# EAGLE design tiny4l_18_1_99 (EAGLE 6.1)
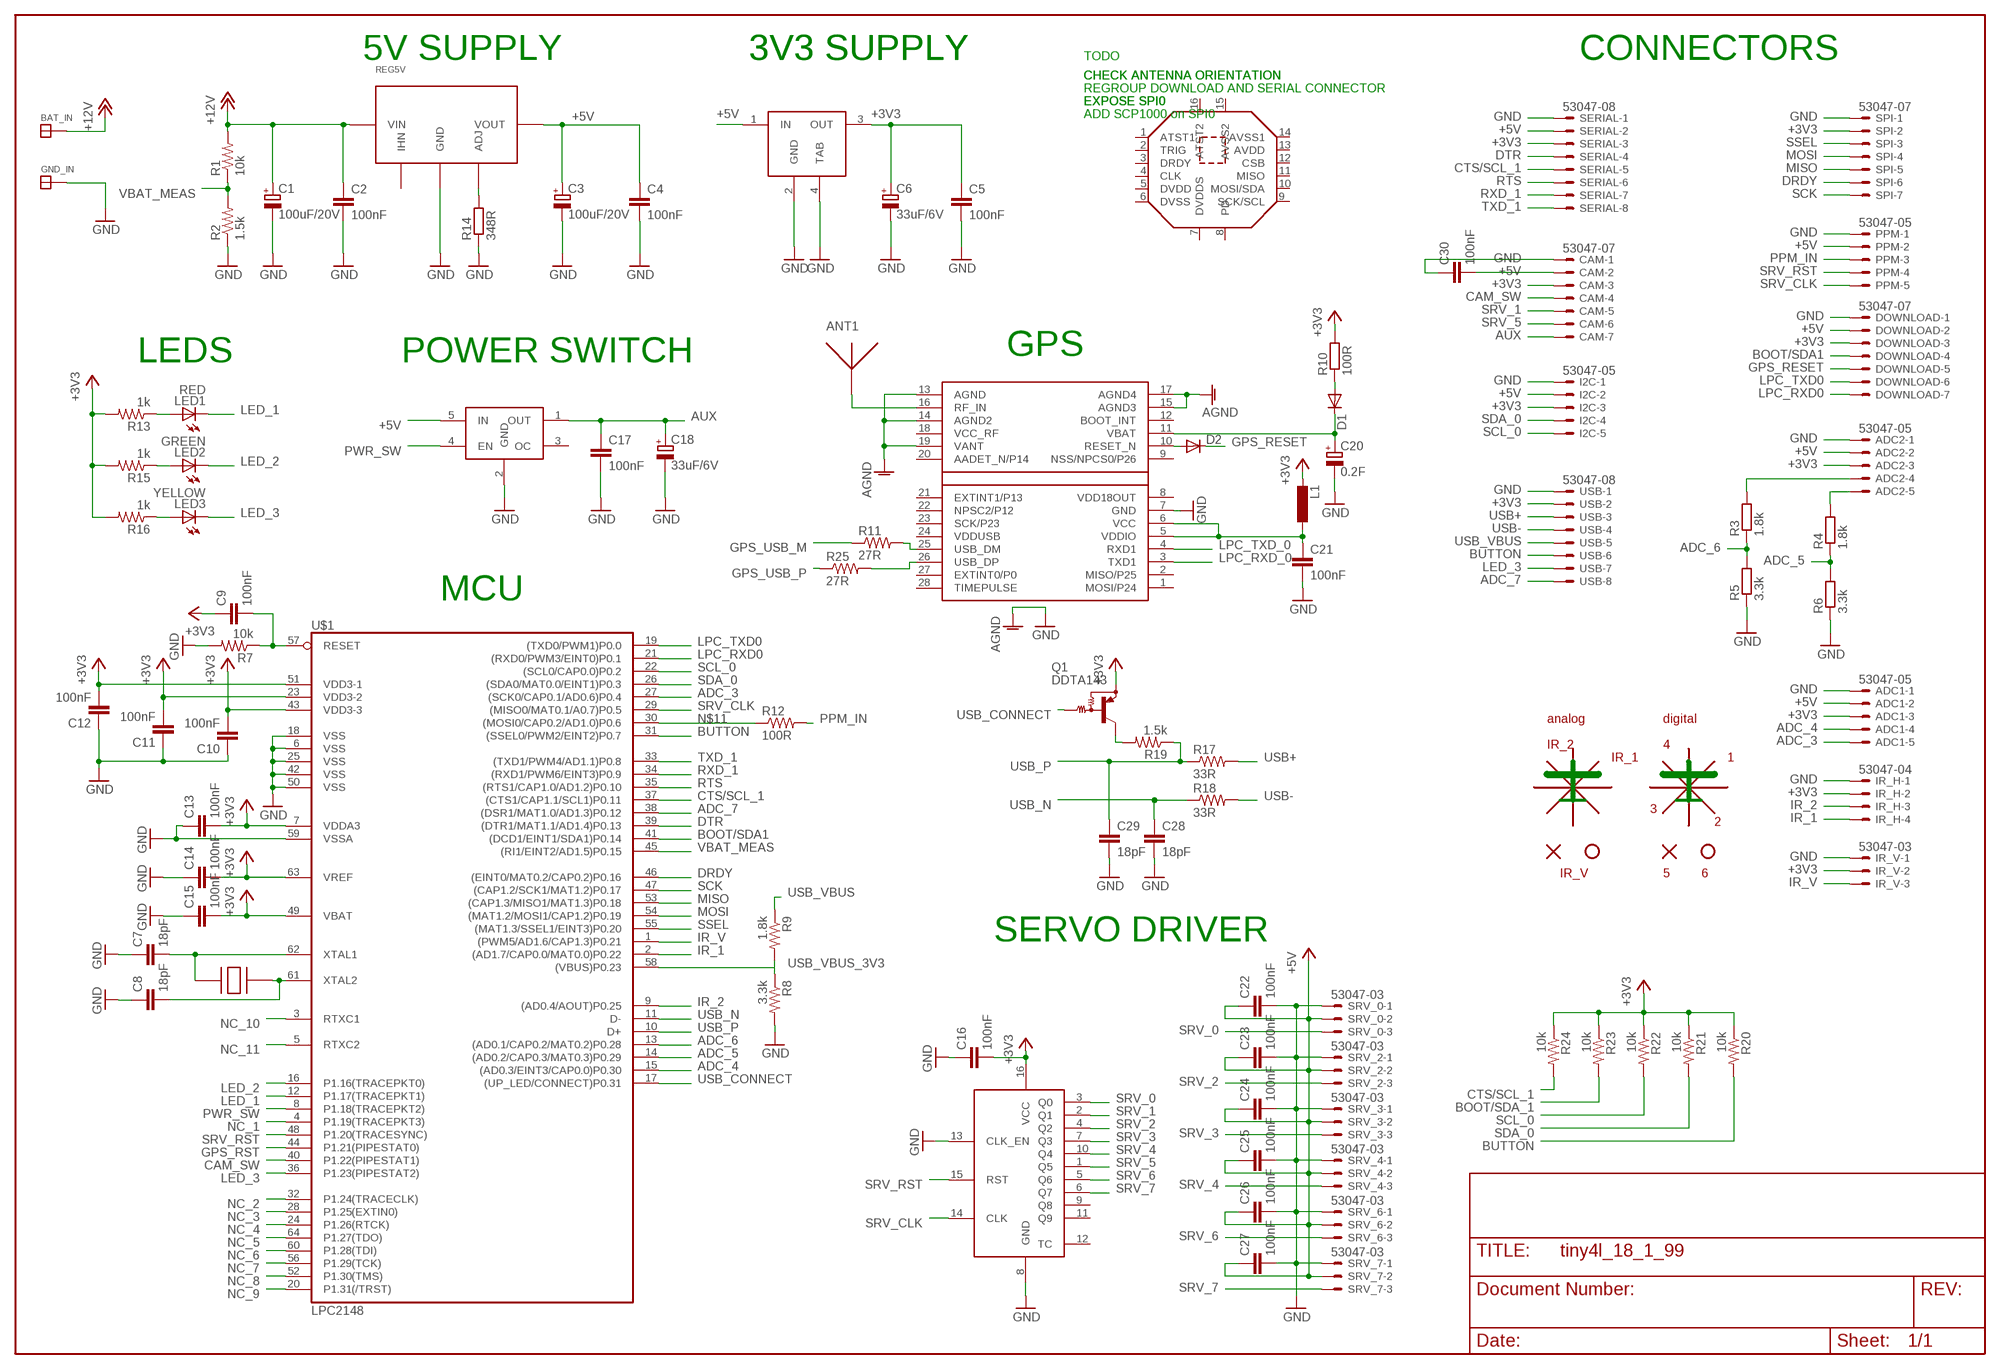
[diagram p0: schematic, sheet 1]

## Parts
ADC1  53047-05  [53047-05]
ADC2  53047-05  [53047-05]
ANT1  GPS_ANT_1318  [ANT_18]
BAT_IN  SOLDER_PAD150_75  [SOLD_PAD_150_75]
C1  100uF/20V  CPOL-EUSMCD  [SMC_D]
C2  100nF  C-EUC0603  [C0603]
C3  100uF/20V  CPOL-EUSMCD  [SMC_D]
C4  100nF  C-EUC0603  [C0603]
C5  100nF  C-EUC0603  [C0603]
C6  33uF/6V  CPOL-EUCT3216  [CT3216]
C7  18pF  C-EUC0603  [C0603]
C8  18pF  C-EUC0603  [C0603]
C9  100nF  C-EUC0603  [C0603]
C10  100nF  C-EUC0603  [C0603]
C11  100nF  C-EUC0603  [C0603]
C12  100nF  C-EUC0603  [C0603]
C13  100nF  C-EUC0603  [C0603]
C14  100nF  C-EUC0603  [C0603]
C15  100nF  C-EUC0603  [C0603]
C16  100nF  C-EUC0603  [C0603]
C17  100nF  C-EUC0603  [C0603]
C18  33uF/6V  CPOL-EUCT3216  [CT3216]
C20  0.2F  PANA_GOLDCAP_J1ROUND  [PANA_J1_BIS]
C21  100nF  C-EUC0603  [C0603]
C22  100nF  C-EUC0603  [C0603]
C23  100nF  C-EUC0603  [C0603]
C24  100nF  C-EUC0603  [C0603]
C25  100nF  C-EUC0603  [C0603]
C26  100nF  C-EUC0603  [C0603]
C27  100nF  C-EUC0603  [C0603]
C28  18pF  C-EUC0603  [C0603]
C29  18pF  C-EUC0603  [C0603]
C30  100nF  C-EUC0603  [C0603]
CAM  53047-07  [53047-07]
D1  DIODE-SOD523  [SOD523]
D2  DIODE-SOD523  [SOD523]
DOWNLOAD  53047-07  [53047-07]
GND_IN  SOLDER_PAD150_75  [SOLD_PAD_150_75]
I2C  53047-05  [53047-05]
IR_H  53047-04  [53047-04]
IR_V  53047-03  [53047-03]
L1  L-EUL2012C  [L2012C]
LED1  RED  LEDCHIP-LED0805  [CHIP-LED0805]
LED2  GREEN  LEDCHIP-LED0805  [CHIP-LED0805]
LED3  YELLOW  LEDCHIP-LED0805  [CHIP-LED0805]
PPM  53047-05  [53047-05]
Q1  DDTA143  MUN2111T1  [SC59-BEC]
R1  10k  R-US_R0603  [R0603]
R2  1.5k  R-US_R0603  [R0603]
R3  1.8k  R-EU_R0603  [R0603]
R4  1.8k  R-EU_R0603  [R0603]
R5  3.3k  R-EU_R0603  [R0603]
R6  3.3k  R-EU_R0603  [R0603]
R7  10k  R-US_R0603  [R0603]
R8  3.3k  R-US_R0603  [R0603]
R9  1.8k  R-US_R0603  [R0603]
R10  100R  R-EU_R0603  [R0603]
R11  27R  R-US_R0603  [R0603]
R12  100R  R-US_R0603  [R0603]
R13  1k  R-US_R0603  [R0603]
R14  348R  R-EU_R0603  [R0603]
R15  1k  R-US_R0603  [R0603]
R16  1k  R-US_R0603  [R0603]
R17  33R  R-US_R0603  [R0603]
R18  33R  R-US_R0603  [R0603]
R19  1.5k  R-US_R0603  [R0603]
R20  10k  R-US_R0603  [R0603]
R21  10k  R-US_R0603  [R0603]
R22  10k  R-US_R0603  [R0603]
R23  10k  R-US_R0603  [R0603]
R24  10k  R-US_R0603  [R0603]
R25  27R  R-US_R0603  [R0603]
REG5V  PTH  [PTH]
SERIAL  53047-08  [53047-08]
SPI  53047-07  [53047-07]
SRV_0  53047-03  [53047-03]
SRV_2  53047-03  [53047-03]
SRV_3  53047-03  [53047-03]
SRV_4  53047-03  [53047-03]
SRV_6  53047-03  [53047-03]
SRV_7  53047-03  [53047-03]
U$1  LPC2148  [SQFP-S-10X10-64]
U$2  LEA-4P  [LEA-LA]
U$3  LM3940IMP-3.3  [SOT223-R]
U$4  CRYSTAL_CTS  [CTS_CRYSTAL]
U$5  CD4017B  [TSSOP16]
U$6  TPS2051B  [SOT23-5L]
U$7  SCP1000  [SCP1000]
USB  53047-08  [53047-08]

## Nets
+3V3: ADC1.3 ADC2.3 C5.1 C6.+ C9.1 C10.2 C11.2 C12.2 C13.2 C14.2 C15.2 C16.2 CAM.3 DOWNLOAD.3 I2C.3 IR_H.2 IR_V.2 L1.2 Q1.E R10.2 R13.2 R15.2 R16.2 R20.1 R21.1 R22.1 R23.1 R24.1 SERIAL.3 SPI.2 U$1.7(VDDA3) U$1.23(VDD3-2) U$1.43(VDD3-3) U$1.49(VBAT) U$1.51(VDD3-1) U$1.63(VREF) U$3.3(OUT) U$5.16(VCC) USB.2
+5V: ADC1.2 ADC2.2 C3.+ C4.1 C22.1 C23.1 C24.1 C25.1 C26.1 C27.1 C30.2 CAM.2 DOWNLOAD.2 I2C.2 PPM.2 REG5V.P$3(VOUT) SERIAL.2 SRV_0.2 SRV_2.2 SRV_3.2 SRV_4.2 SRV_6.2 SRV_7.2 U$3.1(IN) U$6.5(IN)
+12V: BAT_IN.P$1 C1.+ C2.1 R1.2 REG5V.P$1(VIN)
ADC_3: ADC1.5 U$1.27((SCK0/CAP0.1/AD0.6)P0.4)
ADC_4: ADC1.4 U$1.15((AD0.3/EINT3/CAP0.0)P0.30)
ADC_5: R4.1 R6.2 U$1.14((AD0.2/CAP0.3/MAT0.3)P0.29)
ADC_6: R3.1 R5.2 U$1.13((AD0.1/CAP0.2/MAT0.2)P0.28)
ADC_7: U$1.38((DSR1/MAT1.0/AD1.3)P0.12) USB.8
AGND: U$2.13(AGND) U$2.14(AGND2) U$2.15(AGND3) U$2.17(AGND4) U$2.19(VANT) ; supply symbol labelled GND
AUX: C17.1 C18.+ CAM.7 U$6.1(OUT)
BOOT/SDA1: DOWNLOAD.4 U$1.41((DCD1/EINT1/SDA1)P0.14)
BOOT/SDA_1: R23.2
BUTTON: R20.2 U$1.31((SSEL0/PWM2/EINT2)P0.7) USB.6
CAM_SW: CAM.4 U$1.40(P1.22(PIPESTAT1))
CTS/SCL_1: R24.2 SERIAL.5 U$1.37((CTS1/CAP1.1/SCL1)P0.11)
DRDY: SPI.6 U$1.46((EINT0/MAT0.2/CAP0.2)P0.16)
DTR: SERIAL.4 U$1.39((DTR1/MAT1.1/AD1.4)P0.13)
GND: ADC1.1 ADC2.1 C1.- C2.2 C3.- C4.2 C5.2 C6.- C7.1 C8.1 C10.1 C11.1 C12.1 C13.1 C14.1 C15.1 C16.1 C17.2 C18.- C20.MINUS(-) C21.2 C22.2 C23.2 C24.2 C25.2 C26.2 C27.2 C28.2 C29.2 C30.1 CAM.1 DOWNLOAD.1 GND_IN.P$1 I2C.1 IR_H.1 IR_V.1 PPM.1 R2.1 R5.1 R6.1 R7.2 R8.2 R14.1 REG5V.P$2(GND) SERIAL.1 SPI.1 SRV_0.1 SRV_2.1 SRV_3.1 SRV_4.1 SRV_6.1 SRV_7.1 U$1.6(VSS) U$1.18(VSS) U$1.25(VSS) U$1.42(VSS) U$1.50(VSS) U$1.59(VSSA) U$2.7(GND) U$3.2(GND) U$3.4(TAB) U$5.8(GND) U$5.13(CLK_EN) U$6.2(GND) USB.1
GPS_RESET: D2.C DOWNLOAD.5
GPS_RST: U$1.44(P1.21(PIPESTAT0))
GPS_USB_M: R11.1
GPS_USB_P: R25.1
IR_1: IR_H.4 U$1.2((AD1.7/CAP0.0/MAT0.0)P0.22)
IR_2: IR_H.3 U$1.9((AD0.4/AOUT)P0.25)
IR_V: IR_V.3 U$1.1((PWM5/AD1.6/CAP1.3)P0.21)
LED_1: LED1.C U$1.12(P1.17(TRACEPKT1))
LED_2: LED2.C U$1.16(P1.16(TRACEPKT0))
LED_3: LED3.C U$1.36(P1.23(PIPESTAT2)) USB.7
LPC_RESET: C9.2 R7.1 U$1.57(RESET)
LPC_RXD0: DOWNLOAD.7 U$1.21((RXD0/PWM3/EINT0)P0.1)
LPC_RXD_0: U$2.3(TXD1)
LPC_TXD0: DOWNLOAD.6 U$1.19((TXD0/PWM1)P0.0)
LPC_TXD_0: U$2.4(RXD1)
MISO: SPI.5 U$1.53((CAP1.3/MISO1/MAT1.3)P0.18)
MOSI: SPI.4 U$1.54((MAT1.2/MOSI1/CAP1.2)P0.19)
N$1: LED1.A R13.1
N$2: C7.2 U$1.62(XTAL1) U$4.P$1
N$3: D1.A R10.1
N$4: C8.2 U$1.61(XTAL2) U$4.P$3
N$5: R14.2 REG5V.P$4(ADJ)
N$6: LED2.A R15.1
N$7: LED3.A R16.1
N$8: ANT1.P$1 U$2.16(RF_IN)
N$9: D2.A U$2.10(RESET_N)
N$10: C20.PLUS(+) D1.C U$2.11(VBAT)
N$11: R12.1 U$1.30((MOSI0/CAP0.2/AD1.0)P0.6)
N$12: R8.1 R9.2
N$13: C21.1 L1.1 U$2.5(VDDIO) U$2.6(VCC)
N$14: Q1.C R19.2
N$15: R11.2 U$2.25(USB_DM)
N$16: R25.2 U$2.26(USB_DP)
N$43: ADC2.4 R3.2
N$44: ADC2.5 R4.2
NC_1: U$1.4(P1.19(TRACEPKT3))
NC_2: U$1.32(P1.24(TRACECLK))
NC_3: U$1.28(P1.25(EXTIN0))
NC_4: U$1.24(P1.26(RTCK))
NC_5: U$1.64(P1.27(TDO))
NC_6: U$1.60(P1.28(TDI))
NC_7: U$1.56(P1.29(TCK))
NC_8: U$1.52(P1.30(TMS))
NC_9: U$1.20(P1.31(/TRST))
NC_10: U$1.3(RTXC1)
NC_11: U$1.5(RTXC2)
PPM_IN: PPM.3 R12.2
PWR_SW: U$1.8(P1.18(TRACEPKT2)) U$6.4(EN)
RTS: SERIAL.6 U$1.35((RTS1/CAP1.0/AD1.2)P0.10)
RXD_1: SERIAL.7 U$1.34((RXD1/PWM6/EINT3)P0.9)
SCK: SPI.7 U$1.47((CAP1.2/SCK1/MAT1.2)P0.17)
SCL_0: I2C.5 R22.2 U$1.22((SCL0/CAP0.0)P0.2)
SDA_0: I2C.4 R21.2 U$1.26((SDA0/MAT0.0/EINT1)P0.3)
SRV_0: SRV_0.3 U$5.3(Q0)
SRV_1: CAM.5 U$5.2(Q1)
SRV_2: SRV_2.3 U$5.4(Q2)
SRV_3: SRV_3.3 U$5.7(Q3)
SRV_4: SRV_4.3 U$5.10(Q4)
SRV_5: CAM.6 U$5.1(Q5)
SRV_6: SRV_6.3 U$5.5(Q6)
SRV_7: SRV_7.3 U$5.6(Q7)
SRV_CLK: PPM.5 U$1.29((MISO0/MAT0.1/A0.7)P0.5) U$5.14(CLK)
SRV_RST: PPM.4 U$1.48(P1.20(TRACESYNC)) U$5.15(RST)
SSEL: SPI.3 U$1.55((MAT1.3/SSEL1/EINT3)P0.20)
TXD_1: SERIAL.8 U$1.33((TXD1/PWM4/AD1.1)P0.8)
USB+: R17.2 USB.3
USB-: R18.2 USB.4
USB_CONNECT: Q1.B U$1.17((UP_LED/CONNECT)P0.31)
USB_N: C28.1 R18.1 U$1.11(D-)
USB_P: C29.1 R17.1 R19.1 U$1.10(D+)
USB_VBUS: R9.1 USB.5
USB_VBUS_3V3: U$1.58((VBUS)P0.23)
VBAT_MEAS: R1.1 R2.2 U$1.45((RI1/EINT2/AD1.5)P0.15)
Unconnected: REG5V.P$5(IHN) U$2.1(MOSI/P24) U$2.2(MISO/P25) U$2.9(NSS/NPCS0/P26) U$2.12(BOOT_INT) U$2.20(AADET_N/P14) U$2.21(EXTINT1/P13) U$2.22(NPSC2/P12) U$2.23(SCK/P23) U$2.24(VDDUSB) U$2.27(EXTINT0/P0) U$2.28(TIMEPULSE) U$5.9(Q8) U$5.11(Q9) U$5.12(TC) U$6.3(OC) U$7.1(ATST1) U$7.2(TRIG) U$7.3(DRDY) U$7.4(CLK) U$7.5(DVDD) U$7.6(DVSS) U$7.7(DVDDS) U$7.8(PD) U$7.9(SCK/SCL) U$7.10(MOSI/SDA) U$7.11(MISO) U$7.12(CSB) U$7.13(AVDD) U$7.14(AVSS1) U$7.15(AVSS2) U$7.16(ATST2)

## Notes on the sheet
- 5V SUPPLY | 3V3 SUPPLY | 3V3 SUPPLY | TODO | CONNECTORS
- CHECK ANTENNA ORIENTATION | CHECK ANTENNA ORIENTATION
- REGROUP DOWNLOAD AND SERIAL CONNECTOR
- EXPOSE SPI0 | EXPOSE SPI0
- ADD SCP1000 on SPI0
- LEDS | POWER SWITCH | GPS
- MCU
- analog | digital
- IR_2 | 4
- IR_1 | 1
- 3
- 2
- IR_V | 5 | 6
- SERVO DRIVER

## Power pins joined to a net without a drawn wire
VCC_RF: U$2.18(VCC_RF)
VDD18OUT: U$2.8(VDD18OUT)

## Library data of the parts
ADC1 ADC2 I2C PPM = con-molex:53?-05: CONNECTOR wire to board 1.25 mm (.049 inch) pitch header
ANT1 = paparazzi:GPS_ANT_13: Sangshin KSA-ST1575MS13
BAT_IN GND_IN = paparazzi:SOLDER_PAD
C1 C3 C6 C18 = rcl:CPOL-EU: POLARIZED CAPACITOR, European symbol
C2 C4 C5 C7-C17 C21-C30 = rcl:C-EU: CAPACITOR, European symbol
C20 = paparazzi:PANA_GOLDCAP_J1
CAM DOWNLOAD SPI = con-molex:53?-07: CONNECTOR wire to board 1.25 mm (.049 inch) pitch header
D1 D2 = diode:DIODE-: DIODE
IR_H = con-molex:53?-04: CONNECTOR wire to board 1.25 mm (.049 inch) pitch header
IR_V SRV_0 SRV_2-SRV_4 SRV_6 SRV_7 = con-molex:53?-03: CONNECTOR wire to board 1.25 mm (.049 inch) pitch header
L1 = rcl:L-EU: INDUCTOR, European symbol
LED1-LED3 = led:LED: LED OSRAM: - CHIPLED LG R971, LG N971, LY N971, LG Q971, LY Q971, LO R971, LY R971 LH N974, LH R974 LS Q976, LO Q976, LY Q976 LO Q996 - Hyper CHIPLED LW Q18S LB Q993, LB Q99A, LB R99A - SideLED LS A670, LO A670, LY A670, LG A670, LP A670 LB A673, LV A673, LT A673, LW A673 LH A674 LY A675 LS A676, LA A676, LO A676, LY A676, LW A676 LS A679, LY A679, LG A679 - Hyper Micro SIDELED® LS Y876, LA Y876, LO Y876, LY Y876 LT Y87S - SmartLED LW L88C, LW L88S LB L89C, LB L89S, LG L890 LS L89K, LO L89K, LY L89K LS L896, LA L896, LO L896, LY L896 - TOPLED LS T670, LO T670, LY T670, LG T670, LP T670 LSG T670, LSP T670, LSY T670, LOP T670, LYG T670 LG T671, LOG T671, LSG T671 LB T673, LV T673, LT T673, LW T673 LH T674 LS T676, LA T676, LO T676, LY T676, LB T676, LH T676, LSB T676, LW T676 LB T67C, LV T67C, LT T67C, LS T67K, LO T67K, LY T67K, LW E67C LS E67B, LA E67B, LO E67B, LY E67B, LB E67C, LV E67C, LT E67C LW T67C LS T679, LY T679, LG T679 LS T770, LO T770, LY T770, LG T770, LP T770 LB T773, LV T773, LT T773, LW T773 LH T774 LS E675, LA E675, LY E675, LS T675 LS T776, LA T776, LO T776, LY T776, LB T776 LHGB T686 LT T68C, LB T68C - Hyper Mini TOPLED® LB M676 - Mini TOPLED Santana® LG M470 LS M47K, LO M47K, LY M47K Source: http://www.osram.convergy.de - LUMILED® LXK2-PW12-R00, LXK2-PW12-S00, LXK2-PW14-U00, LXK2-PW14-V00 LXK2-PM12-R00, LXK2-PM12-S00, LXK2-PM14-U00 LXK2-PE12-Q00, LXK2-PE12-R00, LXK2-PE12-S00, LXK2-PE14-T00, LXK2-PE14-U00 LXK2-PB12-K00, LXK2-PB12-L00, LXK2-PB12-M00, LXK2-PB14-N00, LXK2-PB14-P00, LXK2-PB14-Q00 LXK2-PR12-L00, LXK2-PR12-M00, LXK2-PR14-Q00, LXK2-PR14-R00 LXK2-PD12-Q00, LXK2-PD12-R00, LXK2-PD12-S00 LXK2-PH12-R00, LXK2-PH12-S00 LXK2-PL12-P00, LXK2-PL12-Q00, LXK2-PL12-R00 Source: www.luxeon.com
Q1 = transistor-pnp:MUN2111*: PNP Bias Resistor Transistor
R1 R2 R7-R9 R11-R13 R15-R25 = rcl:R-US_: RESISTOR, American symbol
R3-R6 R10 R14 = rcl:R-EU_: RESISTOR, European symbol
REG5V = paparazzi:PTH
SERIAL USB = con-molex:53?-08: CONNECTOR wire to board 1.25 mm (.049 inch) pitch header
U$1 = paparazzi:LPC2148
U$2 = paparazzi:LEA-4P
U$3 = paparazzi:LM3940IMP-3.3
U$4 = paparazzi:CRYSTAL_CTS
U$5 = paparazzi:CD4017B
U$6 = paparazzi:TPS2051B
U$7 = paparazzi:SCP1000

## Board
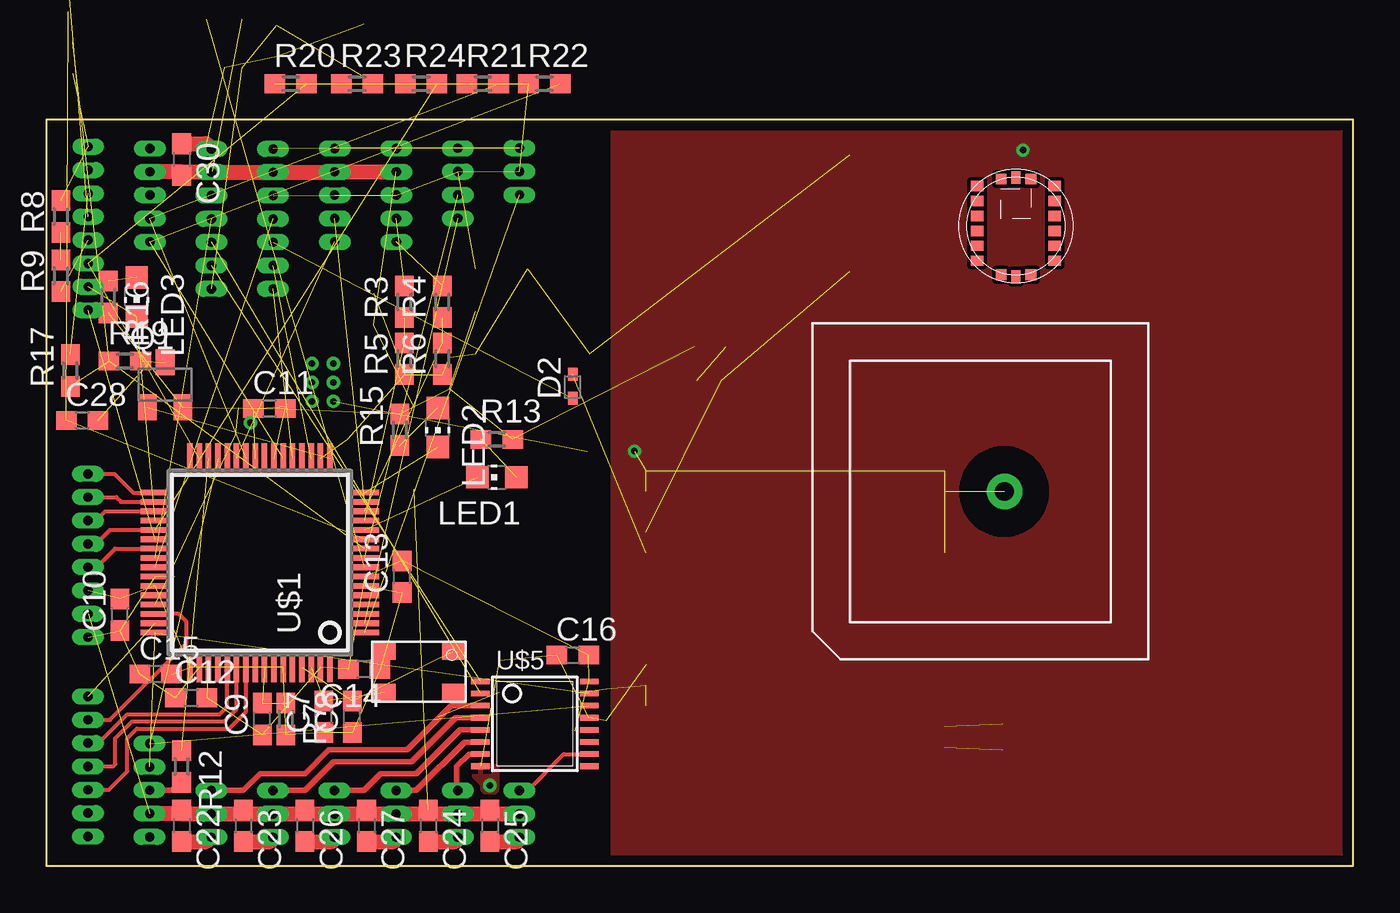
[diagram p1: board, top side]
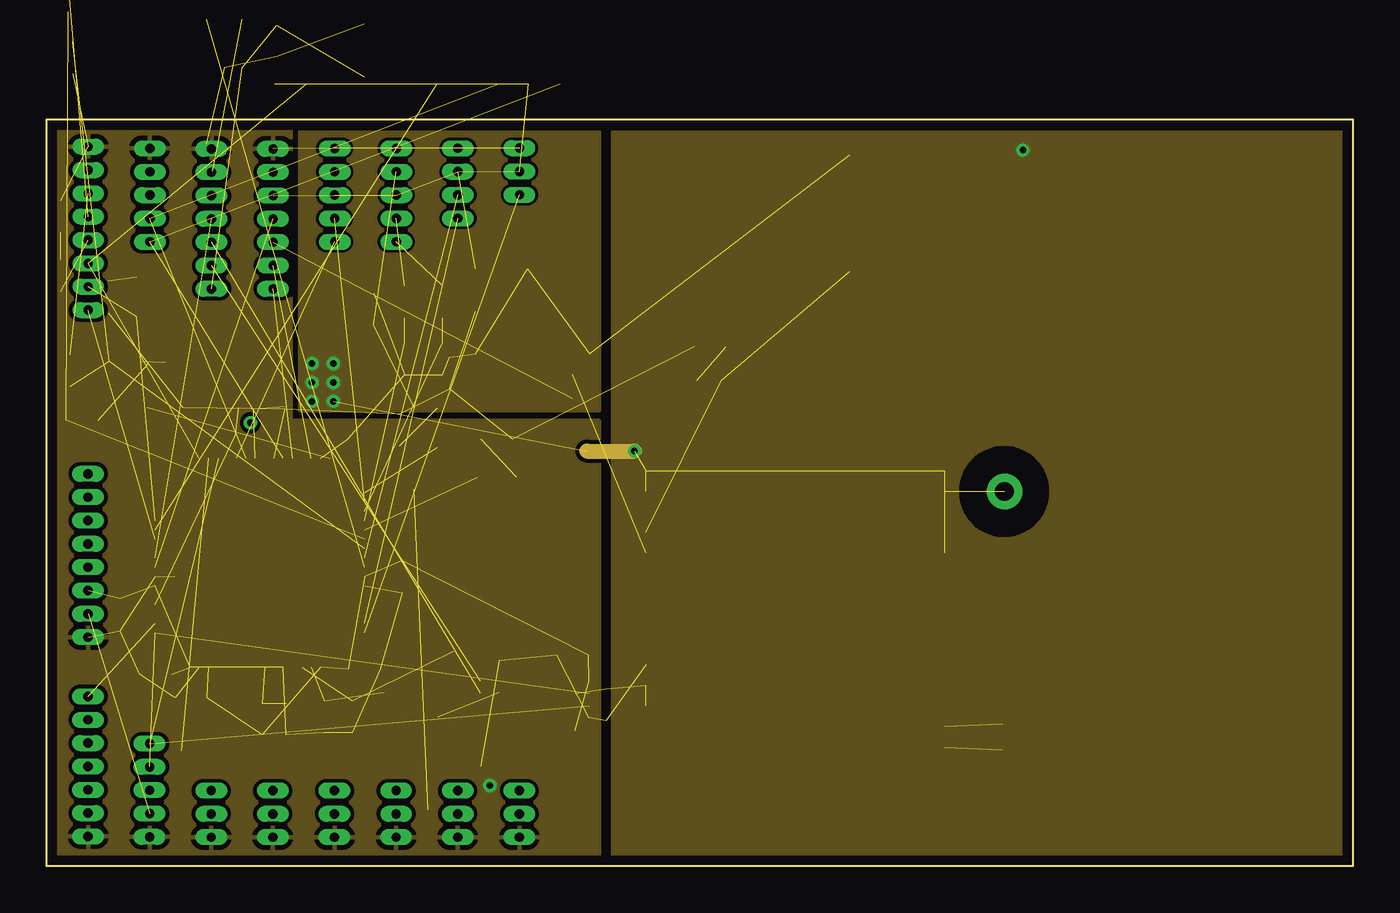
[diagram p2: board, inner layer Route2]
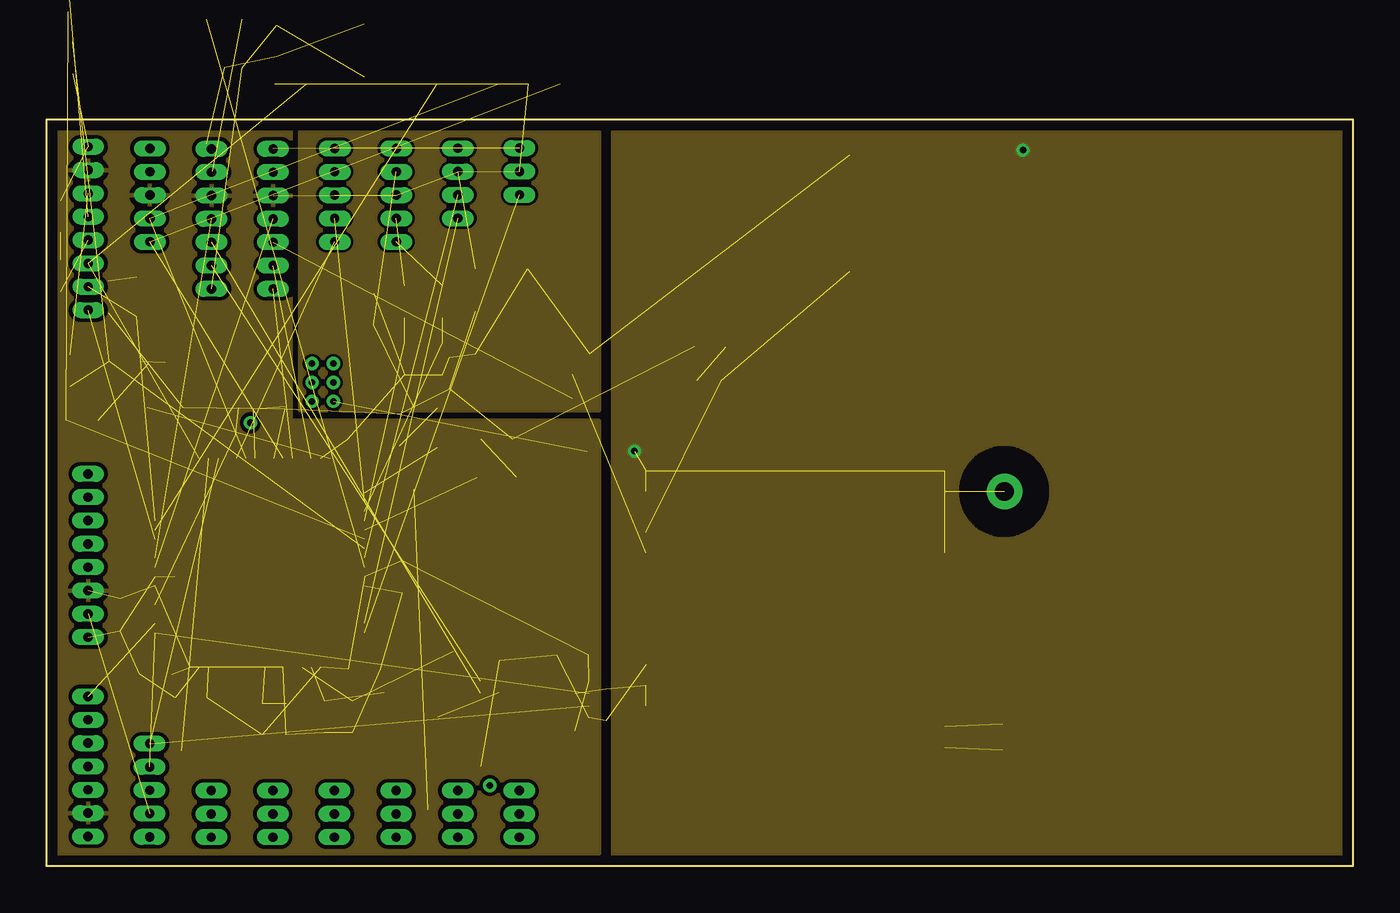
[diagram p3: board, inner layer Route15]
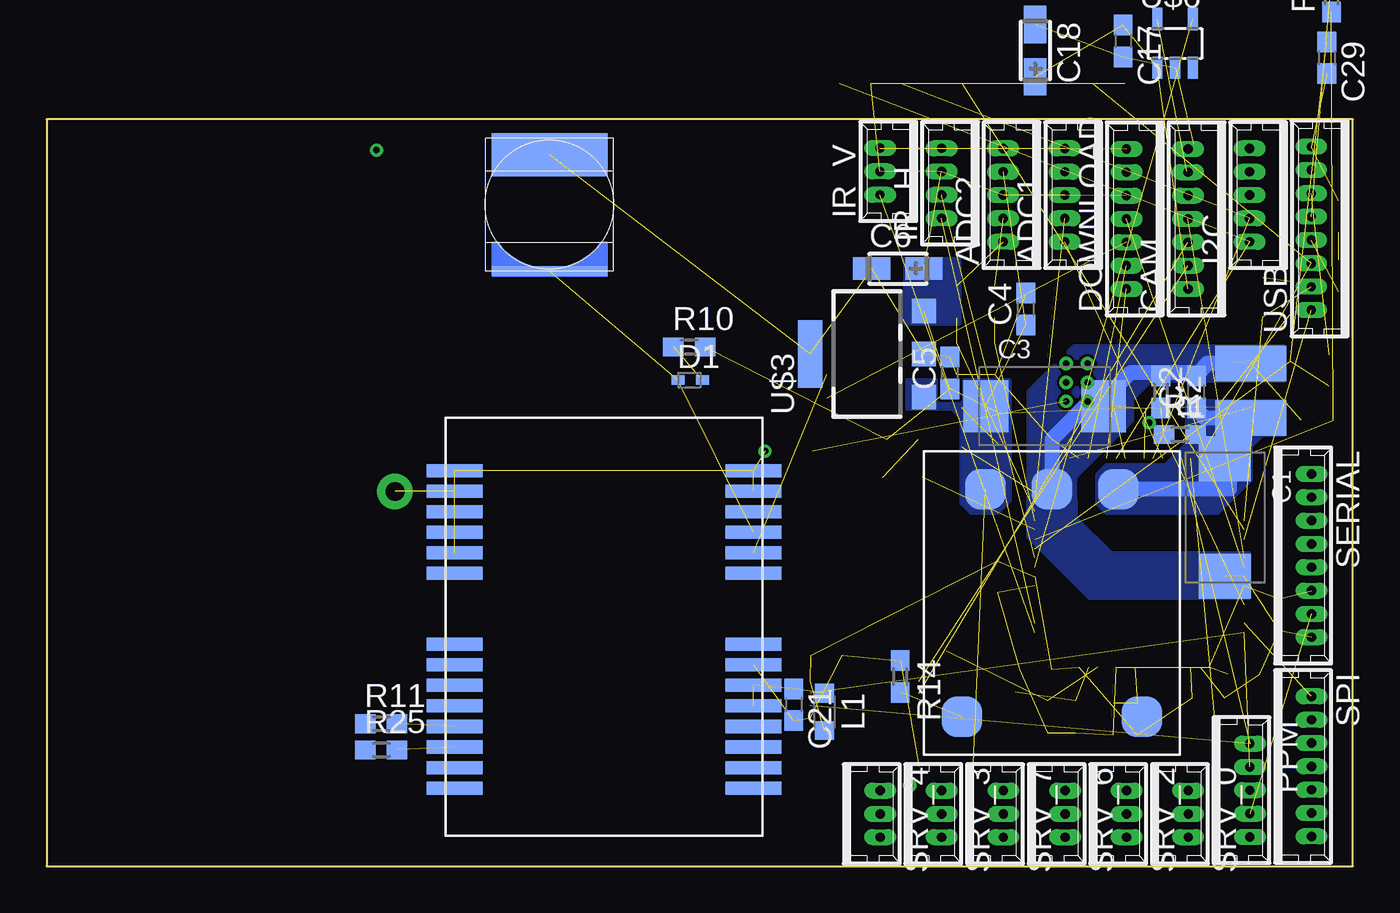
[diagram p4: board, bottom side, seen from below]

Size 70 x 40 mm. Coordinates in mm from the lower left corner, seen from the top.
Outline: 0,0 0,40 70,40 70,0 0,0
Copper layers (1*2+15*16): Top 0.035mm / dielectric 0.2mm / Route2 0.035mm / dielectric 1.5mm / Route15 0.035mm / dielectric 0.2mm / Bottom 0.035mm
Design rules: minimum track width 0.15mm, minimum drill 0.35mm, track to track 0.15mm, track to pad 0.15mm, pad to pad 0.15mm, via to via 0.15mm, smd to smd 0.15mm, copper to edge 20mil, drill to drill 8mil, minimum pad ring 0.177mm, minimum via ring 0.177mm, stop-mask expansion 4mil, vias tented up to drill 0mil, thermal gap 10mil

### Footprints (pad centres in the part's own frame; a part is rotated, then mirrored left to right if it is on the bottom)
53047-05 = drill 0.5 pad 0.698 long: 1 2.5,0.45; 2 1.25,0.45; 3 0,0.45; 4 -1.25,0.45; 5 -2.5,0.45
ANT_18 = drill 1.016 pad 1.905: P$1 0,-1.3
SOLD_PAD_150_75 = smd 3.81 x 1.905: P$1 0,0
SMC_D = smd 2.4 x 2.8: + -3.15,0; - 3.15,0
C0603 = smd 1.1 x 1: 1 -0.85,0; 2 0.85,0
CT3216 = smd 2 x 1.2: + 1.4,0; - -1.4,0
PANA_J1_BIS = smd 6.2 x 2.3: MINUS 0,-2.794 | smd 6.198 x 0.508: PLUS 0,3.429
53047-07 = drill 0.5 pad 0.698 long: 1 3.75,0.45; 2 2.5,0.45; 3 1.25,0.45; 4 0,0.45; 5 -1.25,0.45; 6 -2.5,0.45; 7 -3.75,0.45
SOD523 = smd 0.7 x 0.5: A 0.7,0; C -0.6,0
53047-04 = drill 0.5 pad 0.698 long: 1 1.875,0.45; 2 0.625,0.45; 3 -0.625,0.45; 4 -1.875,0.45
53047-03 = drill 0.5 pad 0.698 long: 1 1.25,0.45; 2 0,0.45; 3 -1.25,0.45
L2012C = smd 1 x 1: 1 -1,0; 2 1,0
CHIP-LED0805 = smd 1.2 x 1.2: A 0,-1.05; C 0,1.05
SC59-BEC = smd 1 x 1.4: B -0.95,-1.2; C 0,1.2; E 0.95,-1.2
R0603 = smd 1.1 x 1: 1 -0.85,0; 2 0.85,0
PTH = smd 2.184 x 2.184: P$1 -6.096,3.556; P$2 -6.096,0; P$3 -6.096,-3.556; P$4 6.096,-4.826; P$5 6.096,4.826
53047-08 = drill 0.5 pad 0.698 long: 1 4.375,0.45; 2 3.125,0.45; 3 1.875,0.45; 4 0.625,0.45; 5 -0.625,0.45; 6 -1.875,0.45; 7 -3.125,0.45; 8 -4.375,0.45
SQFP-S-10X10-64 = smd 0.3 x 1.6: 1 -3.75,-5.6; 2 -3.25,-5.6; 3 -2.75,-5.6; 4 -2.25,-5.6; 5 -1.75,-5.6; 6 -1.25,-5.6; 7 -0.75,-5.6; 8 -0.25,-5.6; 9 0.25,-5.6; 10 0.75,-5.6; 11 1.25,-5.6; 12 1.75,-5.6; 13 2.25,-5.6; 14 2.75,-5.6; 15 3.25,-5.6; 16 3.75,-5.6; 33 3.75,5.6; 34 3.25,5.6; 35 2.75,5.6; 36 2.25,5.6; 37 1.75,5.6; 38 1.25,5.6; 39 0.75,5.6; 40 0.25,5.6; 41 -0.25,5.6; 42 -0.75,5.6; 43 -1.25,5.6; 44 -1.75,5.6; 45 -2.25,5.6; 46 -2.75,5.6; 47 -3.25,5.6; 48 -3.75,5.6 | smd 1.6 x 0.3: 17 5.6,-3.75; 18 5.6,-3.25; 19 5.6,-2.75; 20 5.6,-2.25; 21 5.6,-1.75; 22 5.6,-1.25; 23 5.6,-0.75; 24 5.6,-0.25; 25 5.6,0.25; 26 5.6,0.75; 27 5.6,1.25; 28 5.6,1.75; 29 5.6,2.25; 30 5.6,2.75; 31 5.6,3.25; 32 5.6,3.75; 49 -5.6,3.75; 50 -5.6,3.25; 51 -5.6,2.75; 52 -5.6,2.25; 53 -5.6,1.75; 54 -5.6,1.25; 55 -5.6,0.75; 56 -5.6,0.25; 57 -5.6,-0.25; 58 -5.6,-0.75; 59 -5.6,-1.25; 60 -5.6,-1.75; 61 -5.6,-2.25; 62 -5.6,-2.75; 63 -5.6,-3.25; 64 -5.6,-3.75
LEA-LA = smd 3 x 0.7: 1 8,-8.65; 2 8,-7.55; 3 8,-6.45; 4 8,-5.35; 5 8,-4.25; 6 8,-3.15; 7 8,-2.05; 8 8,-0.95; 9 8,2.85; 10 8,3.95; 11 8,5.05; 12 8,6.15; 13 8,7.25; 14 8,8.35; 15 -8,8.35; 16 -8,7.25; 17 -8,6.15; 18 -8,5.05; 19 -8,3.95; 20 -8,2.85; 21 -8,-0.95; 22 -8,-2.05; 23 -8,-3.15; 24 -8,-4.25; 25 -8,-5.35; 26 -8,-6.45; 27 -8,-7.55; 28 -8,-8.65
SOT223-R = smd 1.3 x 1.3: 1 -2.3,-3.05; 2 0,-3.05; 3 2.3,-3.05 | smd 3.6 x 1.3: 4 0,3.05
CTS_CRYSTAL = smd 1.2 x 0.9: P$1 -1.85,-1.1; P$2 1.85,-1.1; P$3 1.85,1.1; P$4 -1.85,1.1
TSSOP16 = smd 0.305 x 0.991: 1 -2.275,-2.918; 2 -1.625,-2.918; 3 -0.975,-2.918; 4 -0.325,-2.918; 5 0.325,-2.918; 6 0.975,-2.918; 7 1.625,-2.918; 8 2.275,-2.918; 9 2.275,2.918; 10 1.625,2.918; 11 0.975,2.918; 12 0.325,2.918; 13 -0.325,2.918; 14 -0.975,2.918; 15 -1.625,2.918; 16 -2.275,2.918
SOT23-5L = smd 0.55 x 1.2: 1 -0.95,-1.3; 2 0,-1.3; 3 0.95,-1.3; 4 0.95,1.3; 5 -0.95,1.3
SCP1000 = smd 0.67 x 0.55: 1 -2.07,2.135; 2 -2.07,1.335; 3 -2.07,0.535; 4 -2.07,-0.265; 5 -2.07,-1.065; 6 -2.07,-1.865; 9 2.07,-1.865; 10 2.065,-1.06; 11 2.07,-0.265; 12 2.07,0.535; 13 2.07,1.335; 14 2.07,2.135 | smd 0.57 x 0.57: 7 -0.8,-2.615; 8 0.8,-2.615; 15 0.8,2.515; 16 -0.8,2.515 | smd 0.47 x 0.67: NC1 0.005,-2.695; NC2 0,2.6

### Placement (x,y rotation side)
ADC1  14.99,35.94 90 bottom
ADC2  18.29,35.94 90 bottom
ANT1  50.04,20.07 90 top
BAT_IN  5.46,24 0 bottom
C1  6.86,18.67 270 bottom
C2  8.38,25.4 90 bottom
C3  16.51,24.64 0 bottom
C4  17.53,29.84 90 bottom
C5  21.59,26.42 90 bottom
C6  24.38,32 0 bottom
C7  14.86,8 90 top
C8  16.38,8 90 top
C9  11.56,7.87 90 top
C10  3.94,13.46 90 top
C11  11.94,24.51 0 top
C12  7.75,9.02 0 top
C13  19.05,15.49 90 top
C14  17.02,10.54 180 top
C15  5.84,10.29 0 top
C16  28.19,11.3 0 top
C17  12.32,44.2 270 bottom  (outside the outline)
C18  17.02,43.69 270 bottom
C20  43.05,35.31 180 bottom
C21  29.97,8.64 270 bottom
C22  7.24,2.16 270 top
C23  10.54,2.16 270 top
C24  20.45,2.16 270 top
C25  23.75,2.16 270 top
C26  13.84,2.16 270 top
C27  17.14,2.16 270 top
C28  1.91,23.88 0 top
C29  1.4,43.31 270 bottom
C30  7.24,37.85 270 top
CAM  8.38,34.67 90 bottom
D1  35.56,26.04 0 bottom
D2  28.19,25.65 90 top
DOWNLOAD  11.68,34.67 90 bottom
GND_IN  5.46,26.92 0 bottom
I2C  5.08,35.94 90 bottom
IR_H  21.59,36.58 90 bottom
IR_V  24.89,37.21 90 bottom
L1  28.32,8.26 270 bottom
LED1  24.13,20.83 90 top
LED2  20.95,23.5 180 top
LED3  4.83,30.48 180 top
PPM  5.97,4.06 270 bottom
Q1  6.35,25.78 0 top
R1  9.27,23.11 0 bottom
R2  10.29,25.4 270 bottom
R3  19.18,30.23 90 top
R4  21.21,30.23 90 top
R5  19.18,27.18 90 top
R6  21.21,27.18 90 top
R7  12.83,7.87 270 top
R8  0.76,34.8 90 top
R9  0.76,31.62 90 top
R10  35.56,27.81 0 bottom
R11  52.07,7.62 0 bottom
R12  7.24,5.33 270 top
R13  24.13,22.86 0 top
R14  24.26,10.16 270 bottom
R15  18.92,23.37 90 top
R16  3.3,30.48 270 top
R17  1.27,26.54 90 top
R18  1.14,46.61 90 bottom  (outside the outline)
R19  4.19,27.05 0 top
R20  13.08,41.91 0 top
R21  23.37,41.91 0 top
R22  26.67,41.91 0 top
R23  16.64,41.91 0 top
R24  20.07,41.91 0 top
R25  52.07,6.22 0 bottom
REG5V  16.13,14.1 270 bottom
SERIAL  2.67,16.64 270 bottom
SPI  2.67,5.33 270 bottom
SRV_0  9.27,2.79 270 bottom
SRV_2  12.57,2.79 270 bottom
SRV_3  22.48,2.79 270 bottom
SRV_4  25.78,2.79 270 bottom
SRV_6  15.88,2.79 270 bottom
SRV_7  19.18,2.79 270 bottom
U$1  11.43,16.26 90 top
U$2  40.13,12.83 0 bottom
U$3  26.04,27.43 90 bottom
U$4  19.94,10.41 0 top
U$5  26.16,7.62 270 top
U$6  9.53,44.07 0 bottom
U$7  51.94,34.29 0 top
USB  1.78,34.16 90 bottom

### Tracks (layer width: path | path; a pad name or v marks a point on that pad's centre or on a via)
+3V3  (32 unrouted)
  pour Route15 (isolate 0.203): 0.64,39.37 13.08,39.37 13.08,23.88 29.59,23.88 29.59,0.64 0.64,0.64
  pour Bottom (no thermals): 21.08,32.51 24,32.51 24,29.08 21.08,29.08
+5V  (5 unrouted)
  Top 0.813: 7.24,2.81 PPM.2 | 7.24,2.81 8.76,2.81 8.76,2.79 SRV_0.2 10.54,2.79 | 10.54,2.79 SRV_2.2 13.84,2.79 | 13.84,2.79 SRV_6.2 17.14,2.79 | 17.14,2.79 SRV_7.2 20.45,2.79 | 20.45,2.79 SRV_3.2 23.75,2.79 | 23.75,2.79 SRV_4.2 | C22.1 7.24,2.81 | 10.54,2.79 C23.1 | 13.84,2.79 C26.1 | 17.14,2.79 C27.1 | 20.45,2.79 C24.1 | 23.75,2.79 C25.1 | 8.89,37.19 8.89,37.17 | 8.89,37.17 CAM.2 | 7.24,37.19 I2C.2 | 7.24,37.19 8.89,37.19 | 8.89,37.19 8.89,37.21 | 8.89,37.17 DOWNLOAD.2 | DOWNLOAD.2 12.19,37.17 12.19,37.21 | 15.49,37.19 15.49,37.21 | 15.49,37.19 ADC1.2 18.8,37.19 | DOWNLOAD.2 15.49,37.17 15.49,37.19 | 18.8,37.19 ADC2.2 | 18.8,37.19 18.8,37.21 | C30.2 7.24,37.19
  pour Bottom (no thermals): 18.41,19.56 19.05,18.92 20.45,18.92 20.95,19.43 20.95,24 21.46,24.51 23.88,24.51 23.88,26.04 18.54,26.04 18.41,26.04
+12V
  Bottom 0.813: 6.6,21.44 6.6,21.59 | 6.6,21.44 C1.+ 6.86,21.44 | REG5V.P$1 6.6,20.19 6.6,21.44 | 6.86,21.44 6.86,21.34 | 6.86,21.44 6.86,24 BAT_IN.P$1 7.96,24 C2.1
  pour Bottom (no thermals): 3.68,24.89 8.89,24.89 8.89,22.61 10.03,21.46 12.57,21.46 13.21,21.46 13.72,20.95 13.72,19.43 13.21,18.92 7.24,18.92 5.46,20.7 5.46,22.48 4.83,23.11 3.68,23.11
ADC_3  (1 unrouted)
ADC_4  (1 unrouted)
ADC_5  (2 unrouted)
ADC_6  (2 unrouted)
ADC_7  (1 unrouted)
AGND  (via drill 0.35)  (6 unrouted)
  Route2 0.813: 28.96,22.23 v31.5,22.23
  other vias: 52.32,38.35 14.22,26.92 15.37,26.92 14.22,25.91 15.37,25.91 15.37,24.89 14.22,24.89
  pour Route15 (isolate 0.203): 30.35,39.37 51.31,39.37 51.31,22.61 arc90 48.77,20.07 arc90 51.31,17.53 51.31,0.38 30.35,0.38
  pour Route15 (isolate 0.203): 51.31,39.37 69.6,39.37 69.6,0.38 51.31,0.38 51.31,17.53 arc90 53.85,20.07 arc90 51.31,22.61
  pour Route2 (isolate 0.203): 30.35,39.37 51.31,39.37 51.31,22.61 arc90 48.77,20.07 arc90 51.31,17.53 51.31,0.38 30.35,0.38
  pour Route2 (isolate 0.203): 51.31,39.37 69.6,39.37 69.6,0.38 51.31,0.38 51.31,17.53 arc90 53.85,20.07 arc90 51.31,22.61
  pour Top (isolate 0.203): 30.35,39.37 51.31,39.37 51.31,22.61 arc90 48.77,20.07 arc90 51.31,17.53 51.31,0.38 30.35,0.38
  pour Top (isolate 0.203): 51.31,39.37 69.6,39.37 69.6,0.38 51.31,0.38 51.31,17.53 arc90 53.85,20.07 arc90 51.31,22.61
  pour Route2 (no thermals): 29.59,24.38 13.59,24.38 13.59,39.37 29.59,39.37
AUX  (3 unrouted)
AVCC
  pour Route15 (no thermals): 13.59,39.37 29.59,39.37 29.59,24.38 13.59,24.38
BOOT/SDA1  (1 unrouted)
BUTTON  (2 unrouted)
CAM_SW  (1 unrouted)
CTS/SCL_1  (1 unrouted)
  Top 0.203: SERIAL.5 2.66,17.26 3.4,18.01 U$1.37
DRDY
  Top 0.203: SPI.6 3.39,7.83 7.49,11.94 7.49,13.08 7.07,13.51 U$1.46
DTR
  Top 0.203: SERIAL.4 2.68,16.01 3.67,17.01 U$1.39
GND  (via drill 0.35)  (39 unrouted)
  Top 0.813: SRV_0.1 8.78,1.54 8.55,1.31 C22.2 | SRV_2.1 12.17,1.54 12.19,1.52 11.98,1.31 C23.2 | SRV_6.1 15.47,1.54 15.49,1.52 15.28,1.31 C26.2 | SRV_7.1 18.78,1.54 18.8,1.52 18.58,1.31 C27.2 | SRV_3.1 22.08,1.54 22.1,1.52 21.88,1.31 C24.2 | SRV_4.1 25.38,1.54 25.4,1.52 25.18,1.31 C25.2 | CAM.1 8.55,38.7 C30.1
  Bottom 0.813: GND_IN.P$1 7.83,26.92 C2.2 8.68,26.42 11.94,26.42 12.95,25.4 12.95,24.66 C3.- | REG5V.P$2 16.13,22.86 14.35,24.64 C3.- | C3.- 12.83,24.64
  other vias: 23.75,4.32
  pour Route2 (isolate 0.203): 0.25,39.62 13.08,39.62 13.08,23.88 29.59,23.88 29.59,0.38 0.25,0.38
  pour Top: 22.86,5.46 24,5.46 24.13,5.33 24.13,4.06 24,3.94 23.5,3.94 23.37,4.06 23.37,4.32 22.86,4.83
  pour Bottom (no thermals): 3.68,27.81 14.99,27.81 17.4,25.4 17.4,19.56 16.89,19.05 15.37,19.05 14.86,19.56 14.86,20.83 11.81,23.88 11.81,25.02 10.79,26.04 3.68,26.04
  pour Bottom (no thermals): 5.59,16.76 5.59,14.35 9.02,14.35 14.1,14.35 17.27,17.53 17.4,17.65 17.4,19.56 14.86,19.56 14.86,18.67 12.95,16.76
GPS_RESET  (1 unrouted)
IR_1  (1 unrouted)
IR_2  (1 unrouted)
IR_V  (1 unrouted)
LED_1  (1 unrouted)
LED_2  (1 unrouted)
LED_3  (2 unrouted)
LPC_RESET  (2 unrouted)
LPC_RXD0  (1 unrouted)
LPC_TXD0  (1 unrouted)
MISO
  Top 0.203: SPI.5 2.77,6.58 4.32,8.13 9.27,8.13 9.68,8.54 U$1.53
MOSI
  Top 0.203: SPI.4 3.56,5.33 3.68,5.46 3.68,6.86 4.57,7.75 9.53,7.75 10.18,8.4 U$1.54
N$1  (1 unrouted)
N$2  (2 unrouted)
N$3  (1 unrouted)
N$4  (2 unrouted)
N$5  (1 unrouted)
N$6  (1 unrouted)
N$7  (1 unrouted)
N$8  (1 unrouted)
N$9  (1 unrouted)
N$10  (2 unrouted)
N$11  (1 unrouted)
N$12  (1 unrouted)
N$13  (3 unrouted)
N$14  (1 unrouted)
N$15  (1 unrouted)
N$16  (1 unrouted)
N$17  (via drill 0.35)
  other vias: 10.92,23.75
N$43  (1 unrouted)
N$44  (1 unrouted)
PPM_IN
  Top 0.305: R12.2 7.15,4.48 6.73,4.06 PPM.3
PWR_SW  (1 unrouted)
RTS
  Top 0.203: SERIAL.6 2.64,18.51 3.13,19.01 U$1.35
RXD_1
  Top 0.203: SERIAL.7 3.73,19.76 3.99,19.51 U$1.34
SCK  (1 unrouted)
SCL_0  (2 unrouted)
SDA_0  (2 unrouted)
SRV_0
  Top 0.305: U$5.3 21.68,8.6 19.3,6.22 15.11,6.22 13.84,4.95 11.43,4.95 10.54,4.06 8.76,4.06 8.78,4.04 SRV_0.3
SRV_1  (1 unrouted)
SRV_2
  Top 0.305: U$5.4 21.91,7.95 19.56,5.59 15.37,5.59 13.84,4.06 12.19,4.06 12.17,4.04 SRV_2.3
SRV_3
  Top 0.305: U$5.7 22.63,6 21.97,5.33 21.97,4.06 22.01,4.06 SRV_3.3
SRV_4
  Top 0.203: SRV_4.3 25.76,4.04 27.71,6 U$5.10
SRV_5  (1 unrouted)
SRV_6
  Top 0.305: U$5.5 22.15,7.29 19.81,4.95 17.91,4.95 17.02,4.06 15.37,4.06 15.39,4.04 SRV_6.3
SRV_7
  Top 0.305: U$5.6 22.39,6.64 19.81,4.06 18.67,4.06 18.69,4.04 SRV_7.3
SRV_CLK  (2 unrouted)
SRV_RST  (2 unrouted)
SSEL
  Top 0.203: SPI.3 3.32,4.08 4.32,5.08 4.32,6.86 4.83,7.37 9.78,7.37 10.68,8.27 U$1.55
TXD_1
  Top 0.203: U$1.33 4.63,20.01 3.63,21.01 SERIAL.8
USB+  (1 unrouted)
USB-  (1 unrouted)
USB_CONNECT  (1 unrouted)
USB_N  (2 unrouted)
USB_P  (3 unrouted)
USB_VBUS  (1 unrouted)
VBAT_MEAS  (2 unrouted)